# EAGLE schematic sensor (EAGLE 6.3)
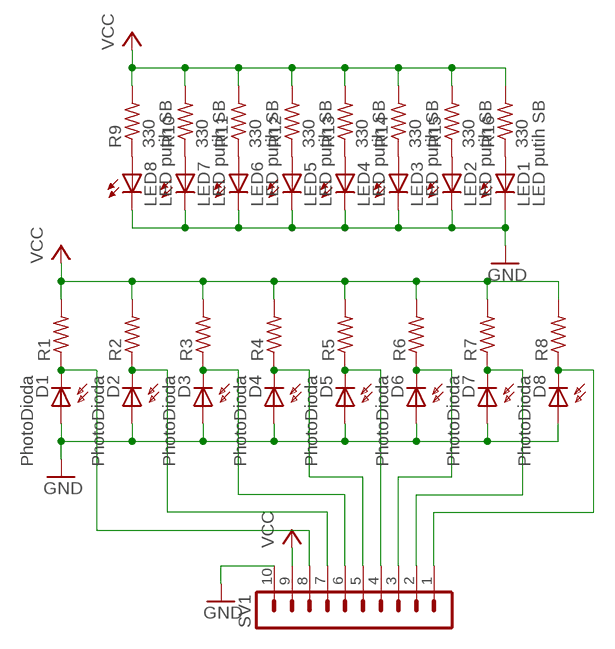
[diagram p0: schematic, sheet 1]

## Parts
D1  PhotoDioda  SFH225  [SFH225]
D2  PhotoDioda  SFH225  [SFH225]
D3  PhotoDioda  SFH225  [SFH225]
D4  PhotoDioda  SFH225  [SFH225]
D5  PhotoDioda  SFH225  [SFH225]
D6  PhotoDioda  SFH225  [SFH225]
D7  PhotoDioda  SFH225  [SFH225]
D8  PhotoDioda  SFH225  [SFH225]
LED1  LED putih SB  LED5MM  [LED5MM]
LED2  LED putih SB  LED5MM  [LED5MM]
LED3  LED putih SB  LED5MM  [LED5MM]
LED4  LED putih SB  LED5MM  [LED5MM]
LED5  LED putih SB  LED5MM  [LED5MM]
LED6  LED putih SB  LED5MM  [LED5MM]
LED7  LED putih SB  LED5MM  [LED5MM]
LED8  LED putih SB  LED5MM  [LED5MM]
R1  R-US_0207/10  [0207/10]
R2  R-US_0207/10  [0207/10]
R3  R-US_0207/10  [0207/10]
R4  R-US_0207/10  [0207/10]
R5  R-US_0207/10  [0207/10]
R6  R-US_0207/10  [0207/10]
R7  R-US_0207/10  [0207/10]
R8  R-US_0207/10  [0207/10]
R9  330  R-US_0207/10  [0207/10]
R10  330  R-US_0207/10  [0207/10]
R11  330  R-US_0207/10  [0207/10]
R12  330  R-US_0207/10  [0207/10]
R13  330  R-US_0207/10  [0207/10]
R14  330  R-US_0207/10  [0207/10]
R15  330  R-US_0207/10  [0207/10]
R16  330  R-US_0207/10  [0207/10]
SV1  MA10-1  [MA10-1]

## Nets
GND: D1.A D2.A D3.A D4.A D5.A D6.A D7.A D8.A LED1.K(C) LED2.K(C) LED3.K(C) LED4.K(C) LED5.K(C) LED6.K(C) LED7.K(C) LED8.K(C) SV1.10
N$1: LED7.A R10.1
N$2: D7.K(C) R7.1 SV1.2
N$3: D8.K(C) R8.1 SV1.1
N$4: D1.K(C) R1.1 SV1.8
N$5: D2.K(C) R2.1 SV1.7
N$6: D3.K(C) R3.1 SV1.6
N$7: D5.K(C) R5.1 SV1.4
N$8: D4.K(C) R4.1 SV1.5
N$9: D6.K(C) R6.1 SV1.3
N$10: LED6.A R11.1
N$11: LED5.A R12.1
N$12: LED4.A R13.1
N$13: LED3.A R14.1
N$14: LED2.A R15.1
N$15: LED1.A R16.1
N$16: LED8.A R9.1
VCC: R1.2 R2.2 R3.2 R4.2 R5.2 R6.2 R7.2 R8.2 R9.2 R10.2 R11.2 R12.2 R13.2 R14.2 R15.2 R16.2 SV1.9

## Library data of the parts
D1-D8 = opto-trans-siemens:SFH225: PHOTO DIODE
LED1-LED8 = led:LED: LED OSRAM: - CHIPLED LG R971, LG N971, LY N971, LG Q971, LY Q971, LO R971, LY R971 LH N974, LH R974 LS Q976, LO Q976, LY Q976 LO Q996 - Hyper CHIPLED LW Q18S LB Q993, LB Q99A, LB R99A - SideLED LS A670, LO A670, LY A670, LG A670, LP A670 LB A673, LV A673, LT A673, LW A673 LH A674 LY A675 LS A676, LA A676, LO A676, LY A676, LW A676 LS A679, LY A679, LG A679 - Hyper Micro SIDELED® LS Y876, LA Y876, LO Y876, LY Y876 LT Y87S - SmartLED LW L88C, LW L88S LB L89C, LB L89S, LG L890 LS L89K, LO L89K, LY L89K LS L896, LA L896, LO L896, LY L896 - TOPLED LS T670, LO T670, LY T670, LG T670, LP T670 LSG T670, LSP T670, LSY T670, LOP T670, LYG T670 LG T671, LOG T671, LSG T671 LB T673, LV T673, LT T673, LW T673 LH T674 LS T676, LA T676, LO T676, LY T676, LB T676, LH T676, LSB T676, LW T676 LB T67C, LV T67C, LT T67C, LS T67K, LO T67K, LY T67K, LW E67C LS E67B, LA E67B, LO E67B, LY E67B, LB E67C, LV E67C, LT E67C LW T67C LS T679, LY T679, LG T679 LS T770, LO T770, LY T770, LG T770, LP T770 LB T773, LV T773, LT T773, LW T773 LH T774 LS E675, LA E675, LY E675, LS T675 LS T776, LA T776, LO T776, LY T776, LB T776 LHGB T686 LT T68C, LB T68C - Hyper Mini TOPLED® LB M676 - Mini TOPLED Santana® LG M470 LS M47K, LO M47K, LY M47K Source: http://www.osram.convergy.de LUXEON: - LUMILED® LXK2-PW12-R00, LXK2-PW12-S00, LXK2-PW14-U00, LXK2-PW14-V00 LXK2-PM12-R00, LXK2-PM12-S00, LXK2-PM14-U00 LXK2-PE12-Q00, LXK2-PE12-R00, LXK2-PE12-S00, LXK2-PE14-T00, LXK2-PE14-U00 LXK2-PB12-K00, LXK2-PB12-L00, LXK2-PB12-M00, LXK2-PB14-N00, LXK2-PB14-P00, LXK2-PB14-Q00 LXK2-PR12-L00, LXK2-PR12-M00, LXK2-PR14-Q00, LXK2-PR14-R00 LXK2-PD12-Q00, LXK2-PD12-R00, LXK2-PD12-S00 LXK2-PH12-R00, LXK2-PH12-S00 LXK2-PL12-P00, LXK2-PL12-Q00, LXK2-PL12-R00 Source: www.luxeon.com KINGBRIGHT: KA-3528ASYC Source: www.kingbright.com
R1-R16 = resistor:R-US_: RESISTOR, American symbol
SV1 = con-lstb:MA10-1: PIN HEADER